# EasyEDA schematic SCH_cookie.json

## Sheets
1 Sheet_1: TITLE: Poisonous Cookie; REV: 1.0; Date: 2025-01-16; Sheet: 1/1; Drawn By: Candy; Company: -
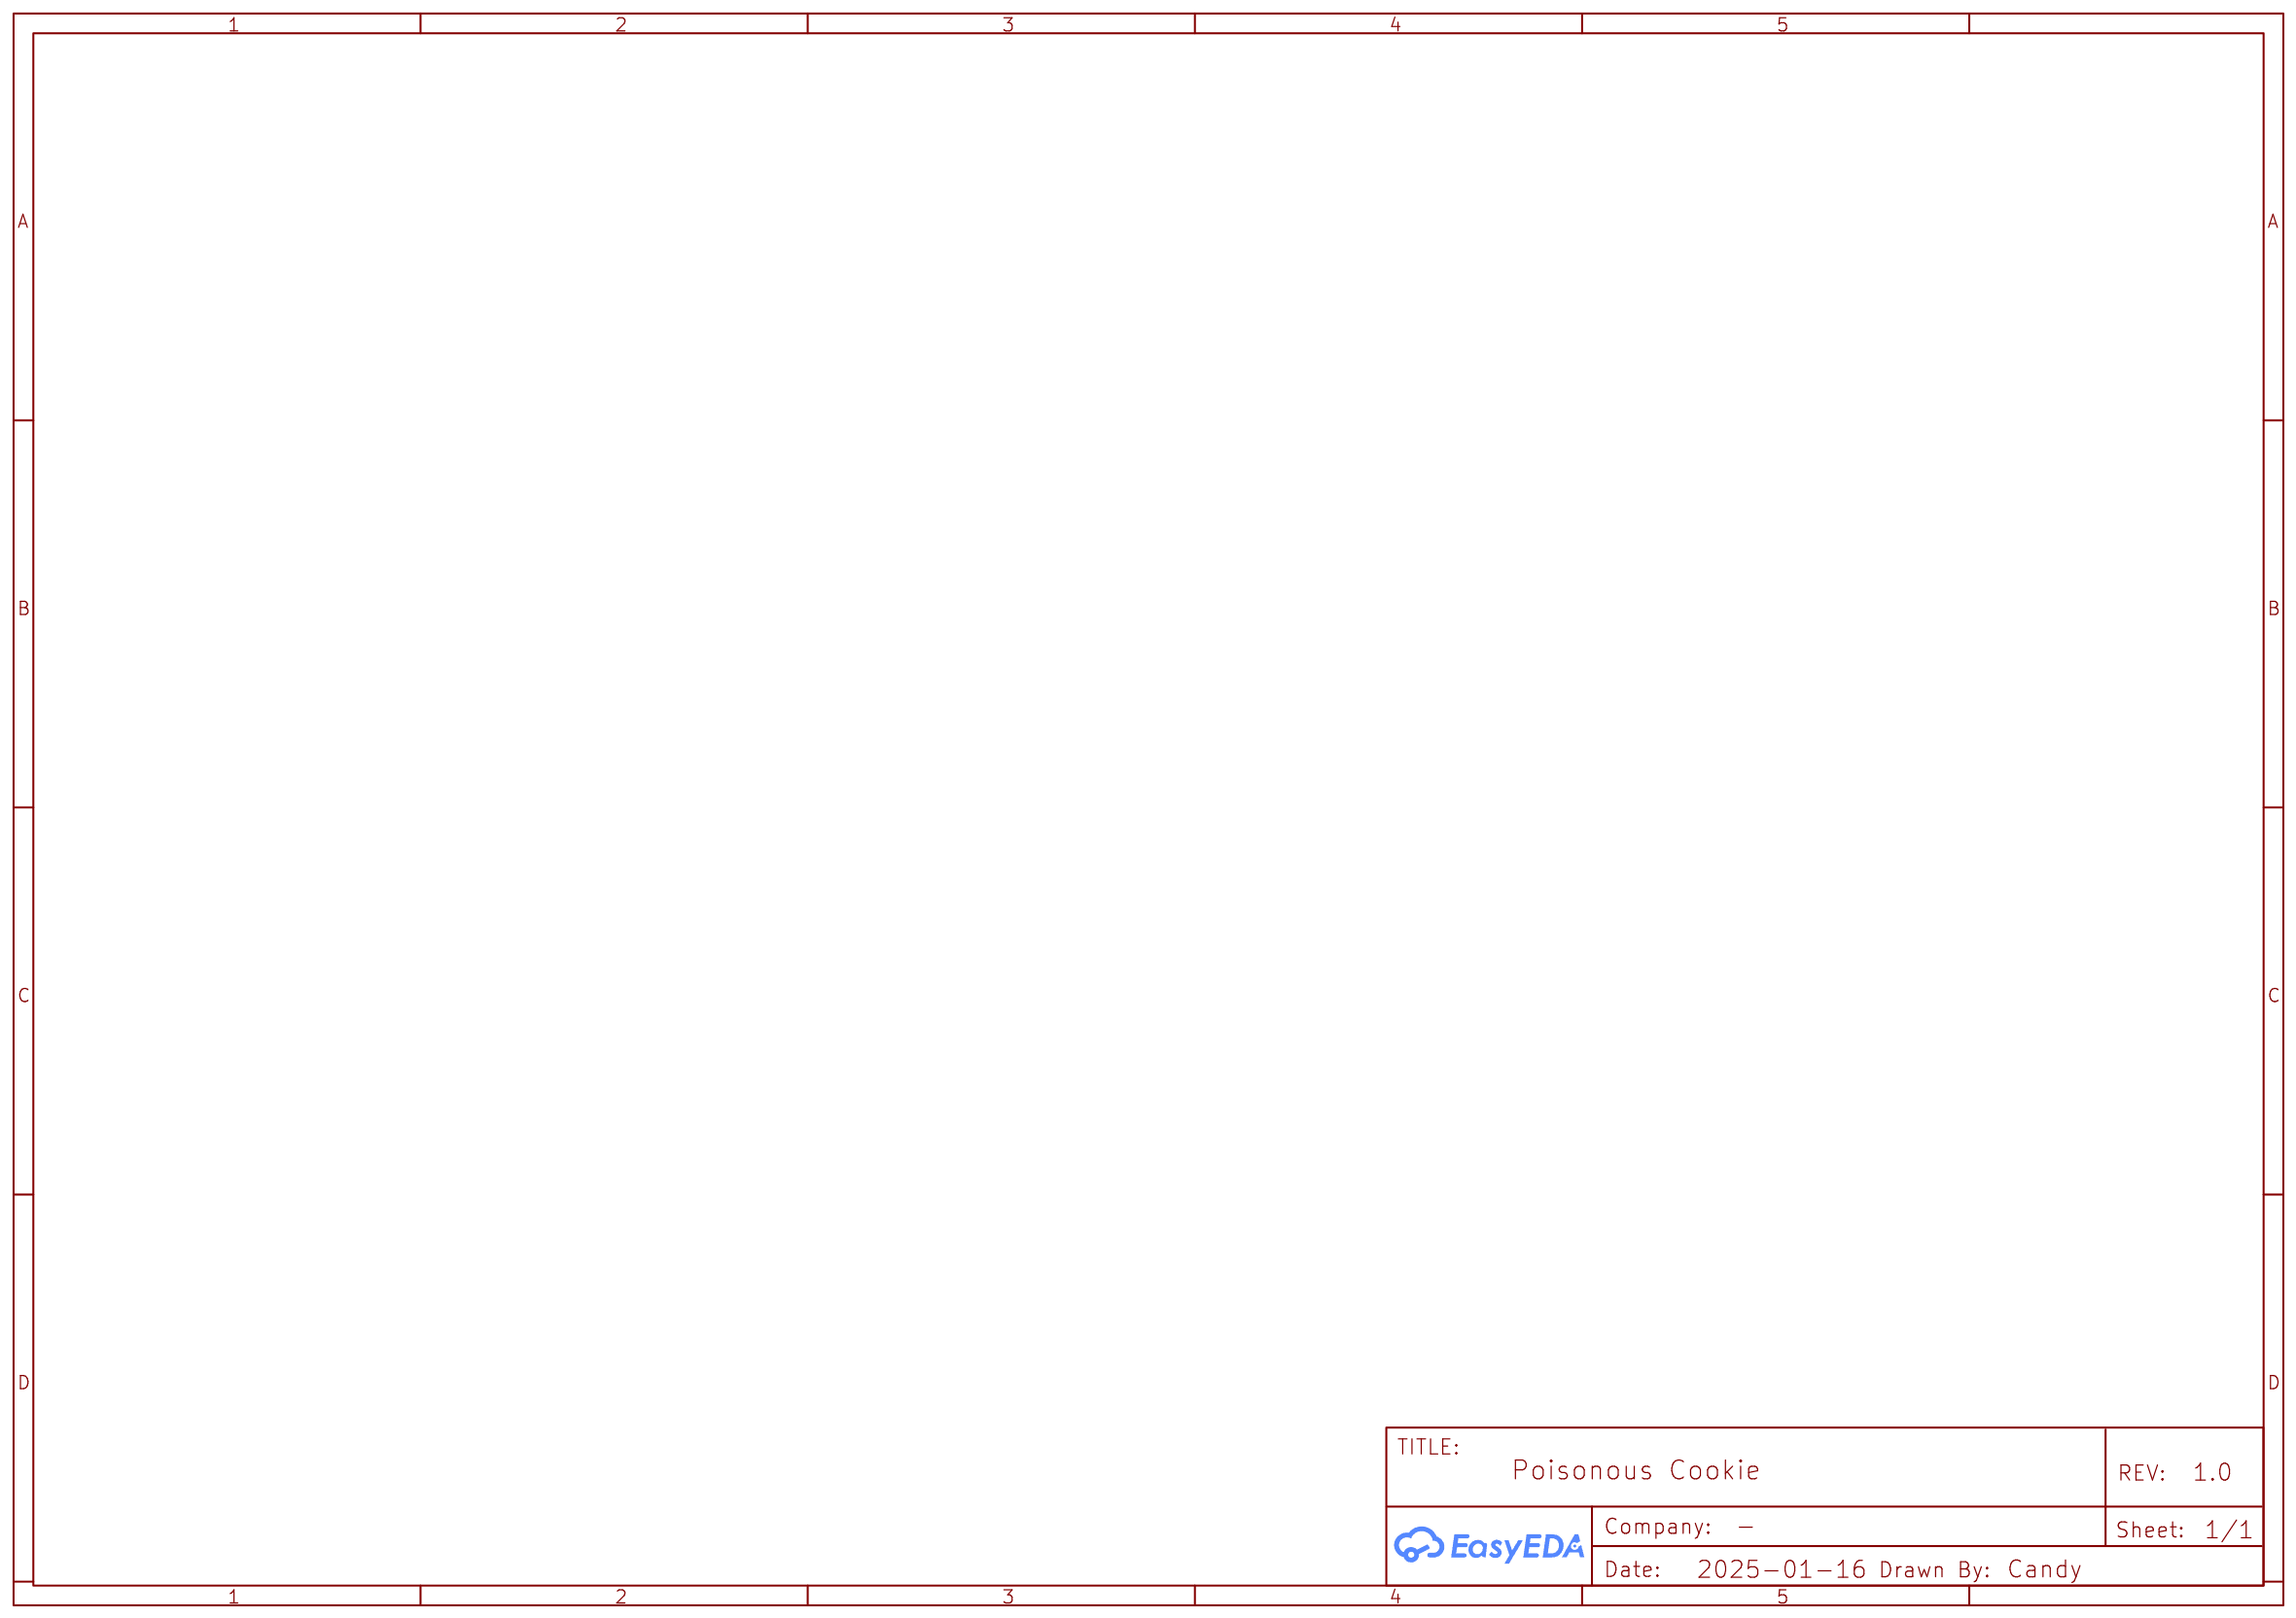
[diagram p0: Sheet_1]
2 rgbw
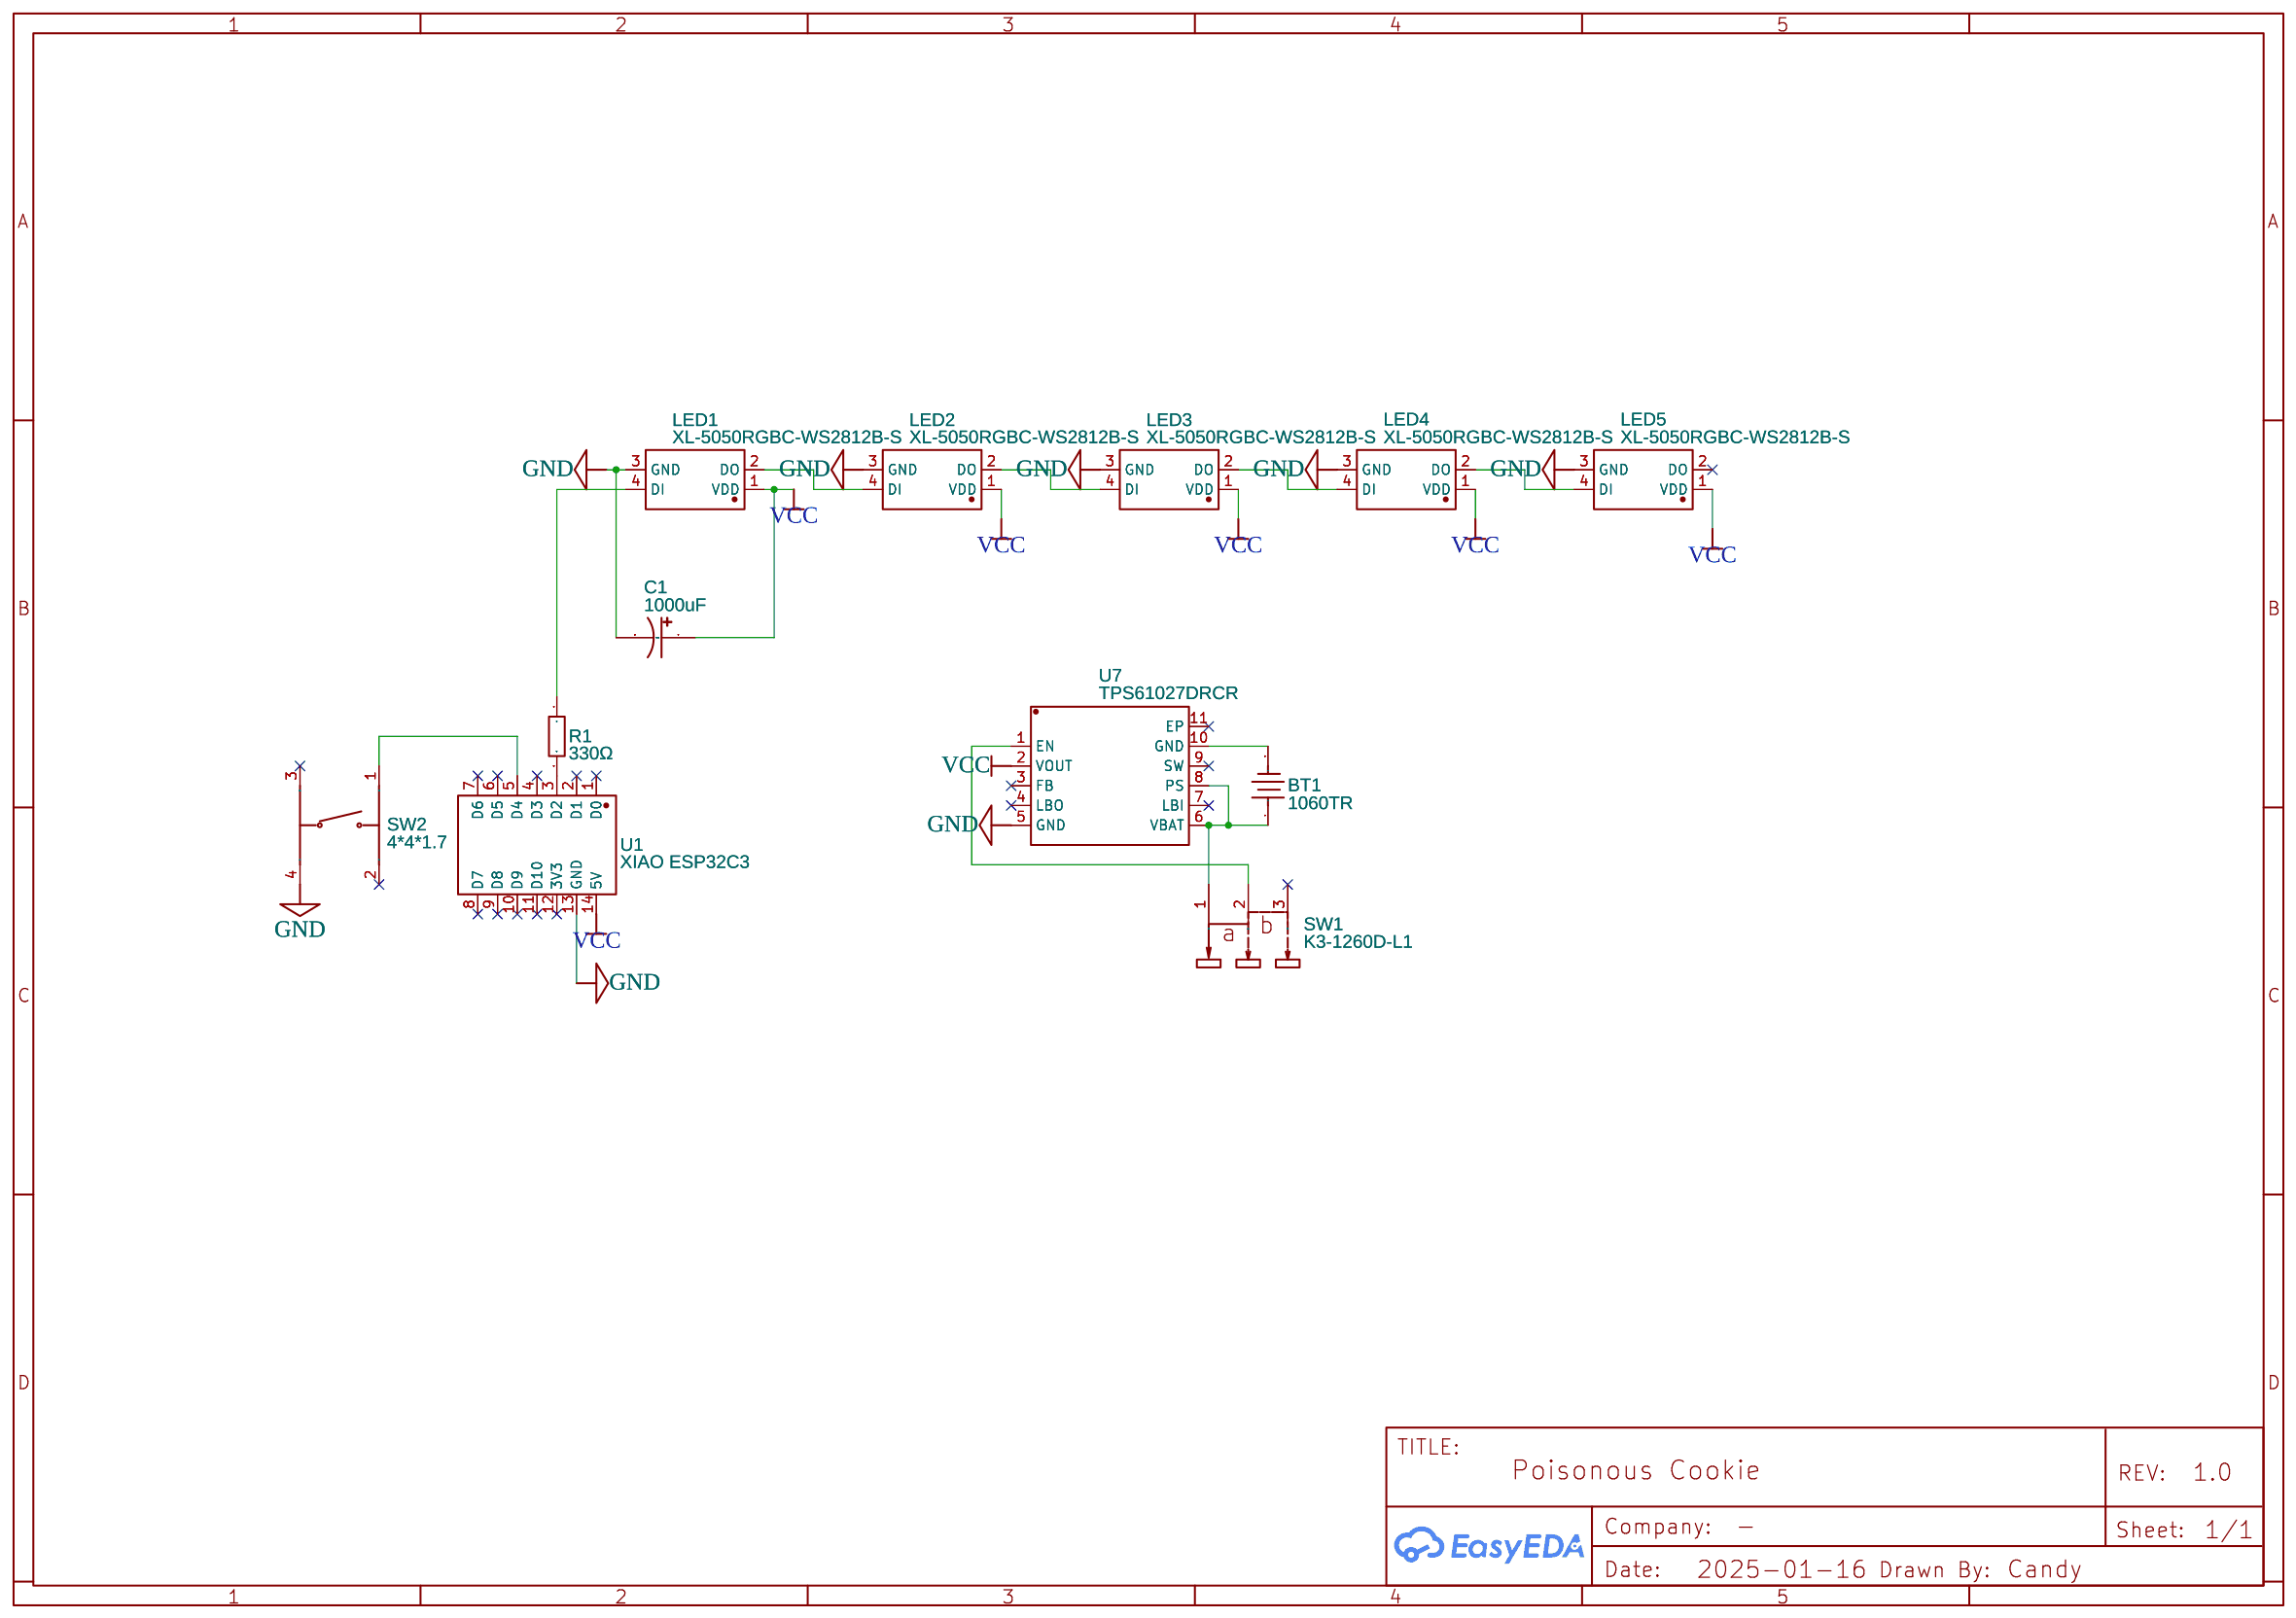
[diagram p1: rgbw]

## Parts
BT1  1060TR  [BAT-SMD_1060TR]
C1  1000uF  [CAP-SMD_BD8.0-L8.4-W8.4-LS9.0-FD]
LED1  XL-5050RGBC-WS2812B-S  [LED-SMD_4P-L5.0-W5.0-TL-1]
LED2  XL-5050RGBC-WS2812B-S  [LED-SMD_4P-L5.0-W5.0-TL-1]
LED3  XL-5050RGBC-WS2812B-S  [LED-SMD_4P-L5.0-W5.0-TL-1]
LED4  XL-5050RGBC-WS2812B-S  [LED-SMD_4P-L5.0-W5.0-TL-1]
LED5  XL-5050RGBC-WS2812B-S  [LED-SMD_4P-L5.0-W5.0-TL-1]
R1  330Ω  [RES-TH_BD3.3-L9.0-P13.00-D0.6]
SW1  K3-1260D-L1  [SW-TH_K3-1260D-L1]
SW2  4*4*1.7  [SW-SMD_4P-L5.2-W5.2-P3.70-LS6.5]
U1  XIAO ESP32C3  [COMM-SMD_KQ-2801_V106]
U7  TPS61027DRCR  [VSON-10_L3.0-W3.0-P0.50-TL-EP_TPS62410DRCR]

## Library data of the parts
BT1 = 1060TR: Contributor: LCSC; Supplier: LCSC; Supplier Part: C238069; Manufacturer: Keystone; JLCPCB Part Class: Extended Part
C1 = OVZ102M0J0812-TRO: Contributor: LCSC; Supplier: LCSC; Supplier Part: C250085; Manufacturer: lelon(立隆); Manufacturer Part: OVZ102M0JTR-0812; JLCPCB Part Class: Extended Part
LED1-LED5 = XL-5050RGBC-WS2812B-S: Supplier: LCSC; Supplier Part: C22461793; Manufacturer: XINGLIGHT(成兴光); Contributor: lcsc; JLCPCB Part Class: Extended Part
R1 = MFR0S2F3300A20: Supplier: LCSC; Manufacturer: UNI-ROYAL(厚声); Supplier Part: C58577; JLCPCB Part Class: Extended Part
SW1 = K3-1260D-L1: Supplier: LCSC; Manufacturer: 韩国韩荣; Supplier Part: C92657; JLCPCB Part Class: Extended Part
SW2 = 4*4*1.7: Contributor: LCSC; Supplier: LCSC; Supplier Part: C10852; Manufacturer: BOOMELE(博穆精密); Manufacturer Part: 4*4*1.7 贴片; JLCPCB Part Class: Extended Part
U1 = XIAO ESP32C3: Supplier: LCSC; Supplier Part: C19189385; Manufacturer: null; JLCPCB Part Class: Extended Part; Contributor: lcsc
U7 = TPS61027DRCR: Contributor: LCSC; Supplier: LCSC; Supplier Part: C80258; Manufacturer: TI(德州仪器); JLCPCB Part Class: Extended Part

## Nets
GND: C1.2 LED1.3(GND) LED2.3(GND) LED3.3(GND) LED4.3(GND) LED5.3(GND) SW2.4 U1.13(GND) U7.5(GND)
VCC: C1.1 LED1.1(VDD) LED2.1(VDD) LED3.1(VDD) LED4.1(VDD) LED5.1(VDD) U1.14(5V) U7.2(VOUT)
Net-(BT1-1): BT1.1(+) SW1.1 U7.6(VBAT) U7.8(PS)
Net-(BT1-2): BT1.2(-) U7.10(GND)
Net-(LED1-2): LED1.2(DO) LED2.4(DI)
Net-(LED1-4): LED1.4(DI) R1.1
Net-(LED2-2): LED2.2(DO) LED3.4(DI)
Net-(LED3-2): LED3.2(DO) LED4.4(DI)
Net-(LED4-2): LED4.2(DO) LED5.4(DI)
Net-(R1-2): R1.2 U1.3(D2)
Net-(SW1-2): SW1.2 U7.1(EN)
Net-(SW2-1): SW2.1 U1.5(D4)

Not connected (* = marked no-connect by the designer): LED5 2(DO)*; SW1 3*; SW2 2* 3*; U1 1(D0)* 2(D1)* 4(D3)* 6(D5)* 7(D6)* 8(D7)* 9(D8)* 10(D9)* 11(D10)* 12(3V3)*; U7 3(FB)* 4(LBO)* 7(LBI)* 9(SW)* 11(EP)*
